# EasyEDA schematic SCH_lhal_2024-10-11.json
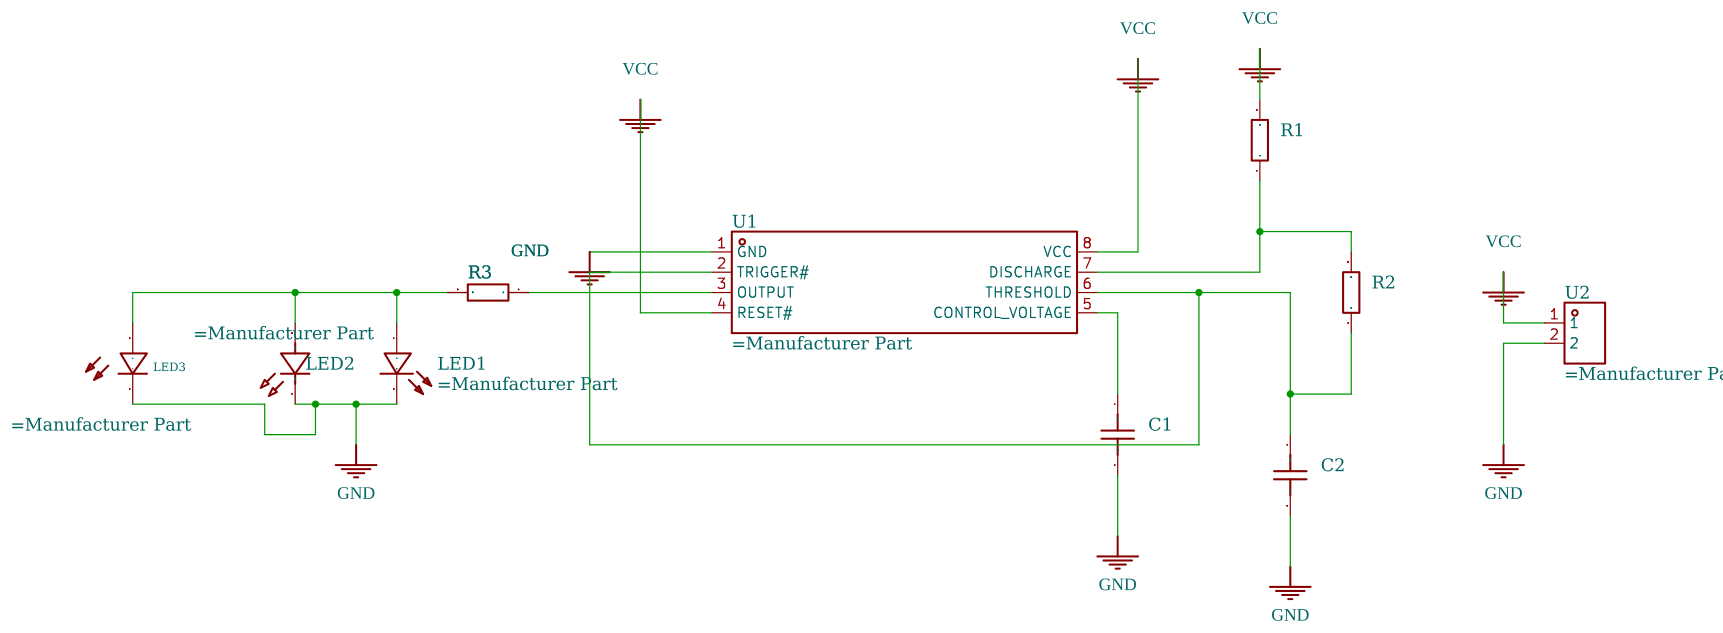
[diagram p0: schematic sheet]

## Parts
C1  0.1u  [C0603]
C2  100uf  [C0603]
LED1  =Manufacturer Part  [LED-TH_BD4.0-P2.54-FD]
LED2  =Manufacturer Part  [LED0402-RD]
LED3  =Manufacturer Part  [LED0402-RD]
R1  5.6K  [R0603]
R2  22K  [R0603]
R3  1K  [R0603]
U1  =Manufacturer Part  [SOP-8_L4.9-W3.9-P1.27-LS6.0-BL]
U2  =Manufacturer Part  [HDR-TH_2P-P2.54-V-M]

## Library data of the parts
C1 C2 = -: Symbol: CAP; Device: CAP_0603; Convert to PCB: yes; Add into BOM: yes; Supplier Footprint: 0603
LED1 = -: Lamp Holder Type:3mm圆形灯头 Emitted Color:Red Forward Voltage (VF):1.8V2.4V Forward Voltage (VF):1.8V2.4V Power Dissipation:60mW Forward Current:20mA Dominant Wavelength:625nm Dominant Wavelength:625nm Peak Wavelength:630nm Diode Configuration:- Lens Color; Symbol: DY-204URC/SN-A3(EL); Device: DY-204URC/SN-A3(EL); LCSC Part Name: 红灯; Supplier Part: C396688; Manufacturer: TONYU(东裕); Manufacturer Part: DY-204URC/SN-A3(EL); Supplier Footprint: 插件,D=3mm; JLCPCB Part Class: Extended Part; Datasheet: https://atta.szlcsc.com/upload/public/pdf/source/20190627/C396688_7AD6A3079C8DA53CF519FB45D5606389.pdf; Supplier: LCSC; Add into BOM: yes; Convert to PCB: yes; Lamp Holder Type: 3mm圆形灯头; Emitted Color: Red; Forward Voltage (VF): 1.8V2.4V; Power Dissipation: 60mW; Forward Current: 20mA; Dominant Wavelength: 625nm; Peak Wavelength: 630nm; Lens Color: 无色透明透镜; Luminous Intensity: 900mcd; Viewing Angle: 20°; Operating Temperature: -25℃+80℃; Comment: DY-204URC/SN-A3(EL)
LED2 = -: Emitted Color:Blue Power Dissipation:111mW Forward Current:20mA Dominant Wavelength:465nm470nm Dominant Wavelength:465nm470nm Peak Wavelength:465nm Diode Configuration:- Lens Color:无色透明透镜 Color Temperature:- Color Temperature:- Viewing Angle:120° Mounti; Symbol: TJ-S1005CL4T5ALC6B-A5; Device: TJ-S1005CL4T5ALC6B-A5; LCSC Part Name: 蓝灯; Supplier Part: C917189; Manufacturer: TOGIALED(统佳); Manufacturer Part: TJ-S1005CL4T5ALC6B-A5; Supplier Footprint: 0402; JLCPCB Part Class: Extended Part; Datasheet: https://atta.szlcsc.com/upload/public/pdf/source/20201110/C917189_DF2A4D6067D69C3E780B1BBA896CB14E.pdf; Supplier: LCSC; Add into BOM: yes; Convert to PCB: yes; Emitted Color: Blue; Power Dissipation: 111mW; Forward Current: 20mA; Dominant Wavelength: 465nm470nm; Peak Wavelength: 465nm; Lens Color: 无色透明透镜; Viewing Angle: 120°; Operating Temperature: -40℃+80℃; Comment: TJ-S1005CL4T5ALC6B-A5
LED3 = -: Emitted Color:Orange Power Dissipation:75mW Forward Current:5mA Dominant Wavelength:605nm Dominant Wavelength:605nm Peak Wavelength:611nm Diode Configuration:- Lens Color:无色透明透镜 Color Temperature:- Color Temperature:- Viewing Angle:130° Mounting Sytle:- O; Symbol: LTST-C281KFKT-5A; Device: LTST-C281KFKT-5A; Supplier: LCSC; Supplier Part: C364554; Manufacturer: LITEON(光宝); Manufacturer Part: LTST-C281KFKT-5A; JLCPCB Part Class: Extended Part; LCSC Part Name: 橙灯; Supplier Footprint: 0402; Datasheet: https://atta.szlcsc.com/upload/public/pdf/source/20190228/C364554_9625FAA35079984173FBEAB4CC17A83F.pdf; Add into BOM: yes; Convert to PCB: yes; Emitted Color: Orange; Power Dissipation: 75mW; Forward Current: 5mA; Dominant Wavelength: 605nm; Peak Wavelength: 611nm; Lens Color: 无色透明透镜; Viewing Angle: 130°; Operating Temperature: -30℃+85℃; Comment: LTST-C281KFKT-5A
R1-R3 = -: Symbol: Res; Device: Res_0603; Convert to PCB: yes; Add into BOM: yes; Supplier Footprint: 0603
U1 = -: Symbol: NE555D_C596355; Device: NE555D; LCSC Part Name: NE555D; Supplier Part: C596355; Manufacturer: HTC; Manufacturer Part: NE555D; Supplier Footprint: SOP-8; JLCPCB Part Class: Extended Part; Datasheet: https://atta.szlcsc.com/upload/public/pdf/source/20200608/C596355_881D2317145BD04E07D637026D4280B2.pdf; Supplier: LCSC; Add into BOM: yes; Convert to PCB: yes; Comment: NE555D
U2 = -: Pin Structure:1x2P Pitch:2.54mm Row Spacing:- Circluar Pins/Square Pins:Square Pins Mounting Type:Straight Number of Rows:Plugin Number of Pins:2P Current Rating (Max):3A Voltage Rating (Max):1kV Length of Mating Pin:6mm Insulation Height:2.5mm Length of; Symbol: ZX-PZ2.54-1-2PZZ; Device: ZX-PZ2.54-1-2PZZ; LCSC Part Name: 1x2P 间距:2.54mm 方针 直插; Supplier Part: C7501260; Manufacturer: Megastar(兆星); Manufacturer Part: ZX-PZ2.54-1-2PZZ; Supplier Footprint: 插件,P=2.54mm; JLCPCB Part Class: Extended Part; Datasheet: https://atta.szlcsc.com/upload/public/pdf/source/20231122/FBB983F7CBC27FD8266BFA93198D2A46.pdf; Supplier: LCSC; Add into BOM: yes; Convert to PCB: yes; Pin Structure: 1x2P; Pitch: 2.54mm; Circluar Pins/Square Pins: Square Pins; Mounting Type: Straight; Number of Rows: Plugin; Number of Pins: 2P; Current Rating (Max): 3A; Voltage Rating (Max): 1kV; Length of Mating Pin: 6mm; Insulation Height: 2.5mm; Length of End Connection Pin: 3mm; Contact Plating: Gold; Operating Temperature Range: -40℃+105℃; Color: Black; Comment: ZX-PZ2.54-1-2PZZ

## Nets
GND: C1.2 C2.2 LED1.2(K) LED2.1(K) LED3.1(-) U1.1(GND) U2.2
VCC: R1.2 U1.4(RESET#) U1.8(VCC) U2.1
Net-(C1-1): C1.1 U1.5(CONTROL VOLTAGE)
Net-(C2-1): C2.1 R2.1 U1.2(TRIGGER#) U1.6(THRESHOLD)
Net-(LED1-1): LED1.1(A) LED2.2(A) LED3.2(+) R3.2
Net-(R1-1): R1.1 R2.2 U1.7(DISCHARGE)
Net-(R3-1): R3.1 U1.3(OUTPUT)

## Notes on the sheet
- 1
- 2
- 3
- 4
- 5
- 6
- A
- A
- B
- B
- C
- C
- Schematic Name
- Update Date
- 2021.11.05
- Schematic
- Create Date
- 2024-10-11
- Page
- P1
- Part Number
- JLCPCB-002
- Drawn
- EasyEDA
- Project Name
- D
- Reviewed
- EasyEDA
- D
- VER
- SIZE
- PAGE
- 1
- OF
- 3
- V0.1
- A4
- EasyEDA.com
- 1
- 2
- 3
- 4
- 5
- 6
